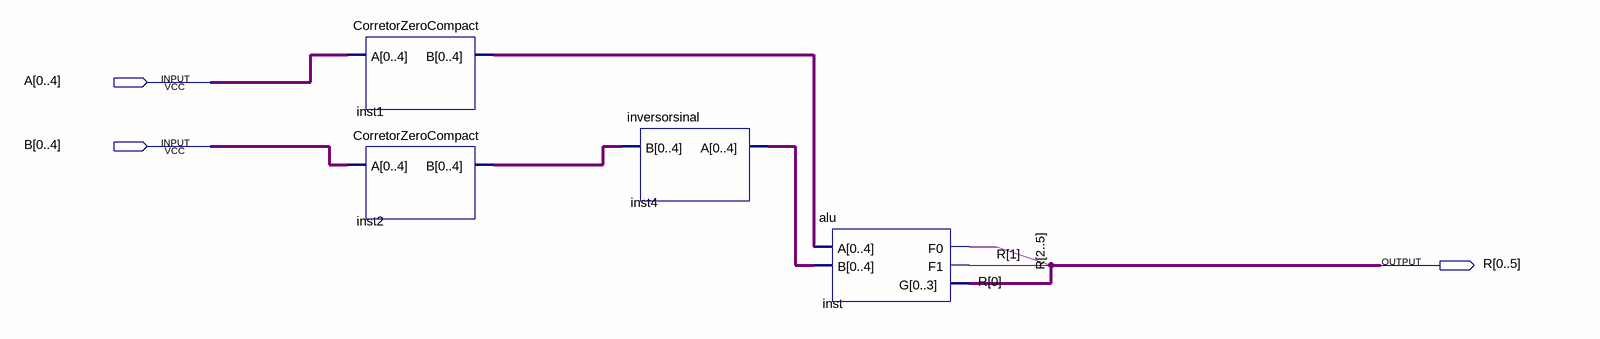
[diagram p0: schematic sheet]
// Quartus schematic Subtrator.bdf as structural Verilog: 4 symbols, 3 pins
module Subtrator (
  input  [0:4] A,
  input  [0:4] B,
  output [0:5] R
);

  wire [4:0] inst1_b, inst2_b, inst4_a;

  CorretorZeroCompact inst1 (.A(A), .B(inst1_b));
  CorretorZeroCompact inst2 (.A(B), .B(inst2_b));
  inversorsinal inst4 (.B(inst2_b), .A(inst4_a));
  alu inst (.A(inst1_b), .B(inst4_a), .F0(R[0]), .F1(R[1]), .G(R[2:5]));
endmodule
